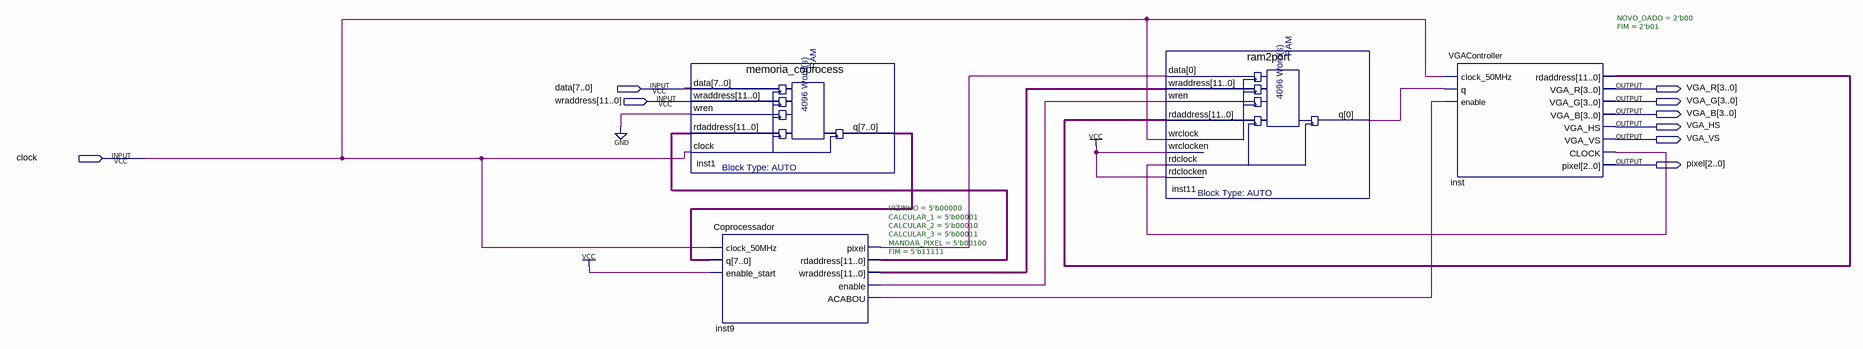
[diagram p0: schematic sheet]
// Quartus schematic PBL3V2.bdf as structural Verilog: 4 symbols, 9 pins
module PBL3V2 (
  input  [7:0] data,
  input  [11:0] wraddress,
  input  clock,
  output [3:0] VGA_R,
  output [3:0] VGA_G,
  output [3:0] VGA_B,
  output VGA_HS,
  output VGA_VS,
  output [2:0] pixel
);

  wire inst9_acabou, inst9_enable, inst9_pixel, inst11_q, inst_clock;
  wire [7:0] inst1_q;
  wire [11:0] inst9_rdaddress, inst9_wraddress, inst_rdaddress;

  memoria_coprocess inst1 (
    .data(data), .wraddress(wraddress), .wren(1'b0), .rdaddress(inst9_rdaddress), .clock(clock), .q(inst1_q));
  Coprocessador #(.VIZINHO(5'b00000), .CALCULAR_1(5'b00001), .CALCULAR_2(5'b00010), .CALCULAR_3(5'b00011), .MANDAR_PIXEL(5'b00100), .FIM(5'b11111)) inst9 (
    .clock_50MHz(clock), .q(inst1_q), .enable_start(1'b1), .pixel(inst9_pixel), .rdaddress(inst9_rdaddress),
    .wraddress(inst9_wraddress), .enable(inst9_enable), .ACABOU(inst9_acabou));
  ram2port inst11 (
    .data(inst9_pixel), .wraddress(inst9_wraddress), .wren(inst9_enable), .rdaddress(inst_rdaddress),
    .wrclock(clock), .wrclocken(1'b1), .rdclock(inst_clock), .rdclocken(1'b1), .q(inst11_q));
  VGAController #(.NOVO_DADO(2'b00), .FIM(2'b01)) inst (
    .clock_50MHz(clock), .q(inst11_q), .enable(inst9_acabou), .rdaddress(inst_rdaddress), .VGA_R(VGA_R),
    .VGA_G(VGA_G), .VGA_B(VGA_B), .VGA_HS(VGA_HS), .VGA_VS(VGA_VS), .CLOCK(inst_clock), .pixel(pixel));
endmodule
